# EasyEDA schematic Schematic_kr04-Color_v1.0.0.json
TITLE: Блок цветности "Электроника-КР04"; REV: 1.0.0; Date: 2024-12-30; Sheet: 1/1; Drawn By: Romych; Company: zx-pk.ru
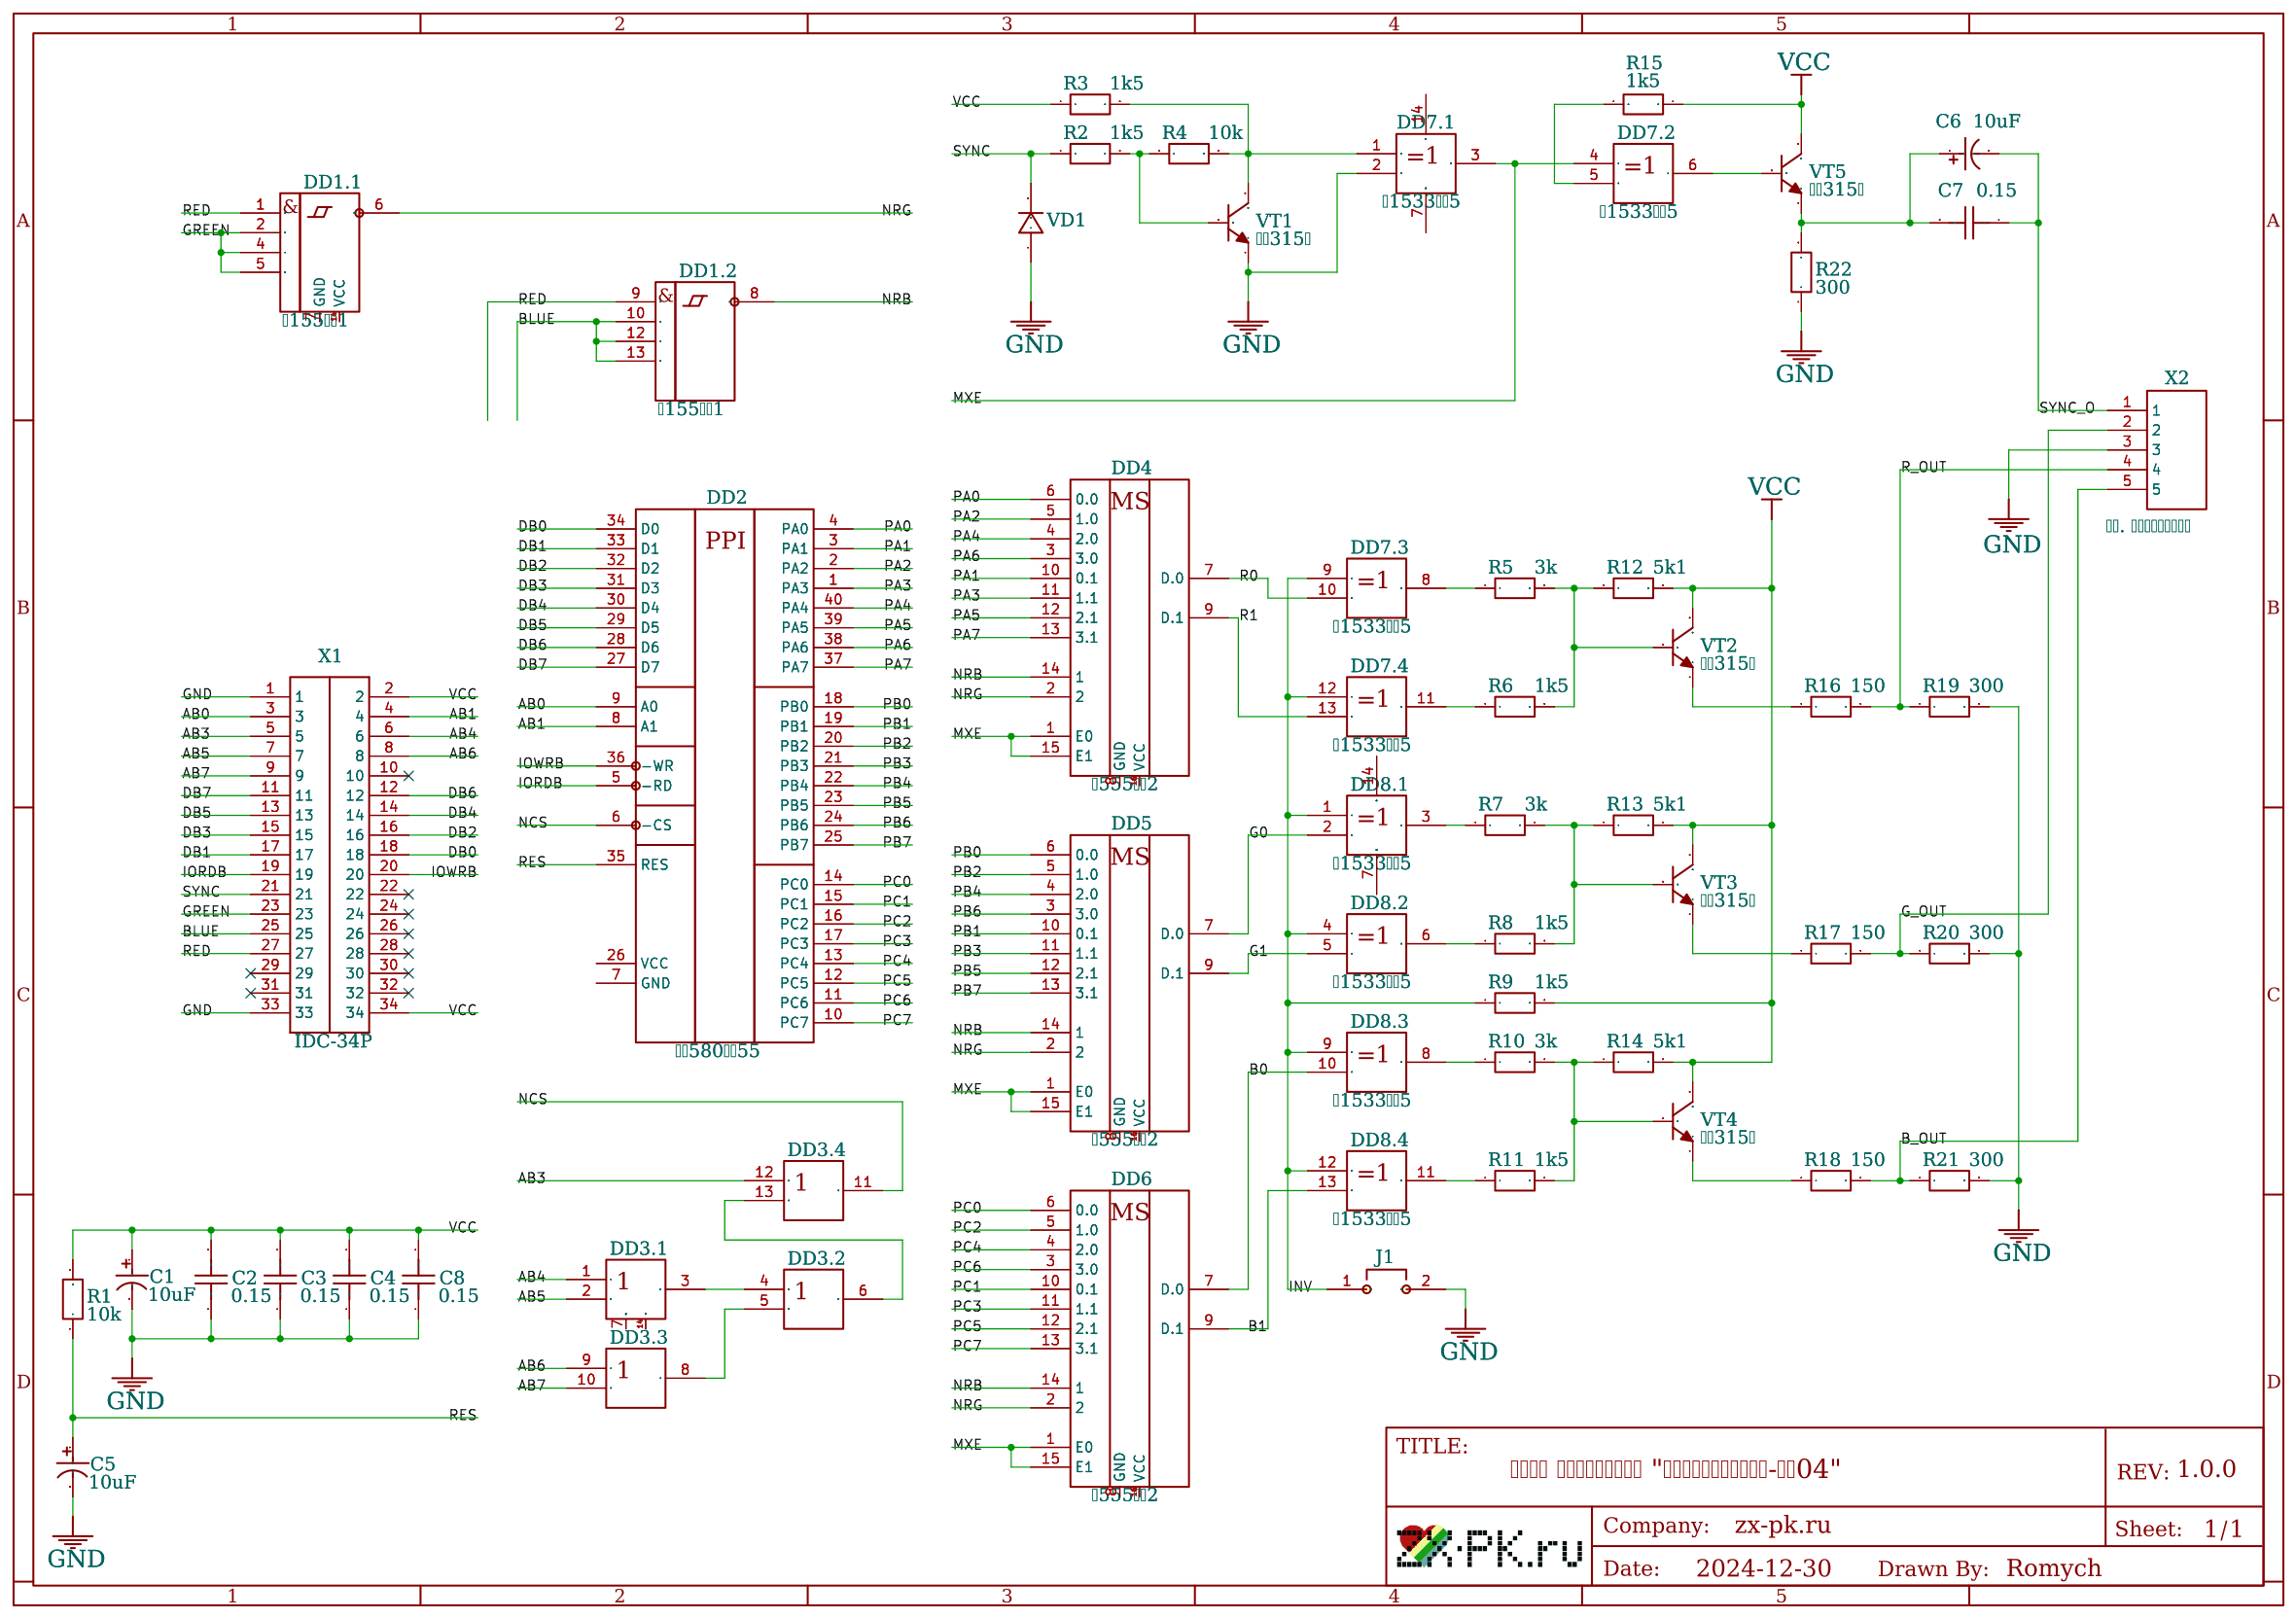
[diagram p0: schematic sheet]

## Parts
C1  10uF  [CAP-TH_BD6.3-P2.50-D1.0-FD]
C2  0.15  [CAP-TH_L5.08]
C3  0.15  [CAP-TH_L5.08]
C4  0.15  [CAP-TH_L5.08]
C5  10uF  [CAP-TH_BD6.3-P2.50-D1.0-FD]
C6  10uF  [CAP-TH_BD6.3-P2.50-D1.0-FD]
C7  0.15  [CAP-TH_L5.08]
C8  0.15  [CAP-TH_L5.08]
DD1  К155ТЛ1  [DIP-14_STD]  (sections 1,2)
DD2  КР580ВВ55  [DIP-40_STD]
DD3  К1533ЛЛ1  [DIP-14_STD]  (sections 1,2,3,4)
DD4  К555КП2  [DIP-16_STD]
DD5  К555КП2  [DIP-16_STD]
DD6  К555КП2  [DIP-16_STD]
DD7  К1533ЛП5  [DIP-14_STD]  (sections 1,2,3,4)
DD8  К1533ЛП5  [DIP-14_STD]  (sections 1,2,3,4)
J1  Inverse  [HDR-TH_2P-P2.54-V-M]
R1  10k  [R_0.125_7.62]
R2  1k5  [R_0.125_7.62]
R3  1k5  [R_0.125_7.62]
R4  10k  [R_0.125_7.62]
R5  3k  [R_0.125_7.62]
R6  1k5  [R_0.125_7.62]
R7  3k  [R_0.125_7.62]
R8  1k5  [R_0.125_7.62]
R9  1k5  [R_0.125_7.62]
R10  3k  [R_0.125_7.62]
R11  1k5  [R_0.125_7.62]
R12  5k1  [R_0.125_7.62]
R13  5k1  [R_0.125_7.62]
R14  5k1  [R_0.125_7.62]
R15  1k5  [R_0.125_7.62]
R16  150  [R_0.125_7.62]
R17  150  [R_0.125_7.62]
R18  150  [R_0.125_7.62]
R19  300  [R_0.125_7.62]
R20  300  [R_0.125_7.62]
R21  300  [R_0.125_7.62]
R22  300  [R_0.125_7.62]
VD1  1N4148  [DIODE_TH_7.62]
VT1  КТ315Б  [KT315_STD]
VT2  КТ315Б  [KT315_STD]
VT3  КТ315Б  [KT315_STD]
VT4  КТ315Б  [KT315_STD]
VT5  КТ315Б  [KT315_STD]
X1  IDC-34P  [IDC-TH-34P-17X2_2.54]
X2  ЦВ. ТЕЛЕВИЗОР  [SG5-TH]

## Library data of the parts
C1 C5 C6 = ECLJ0612220M101P00: Supplier: LCSC; Supplier Part: C156809; Manufacturer: Guangdong TOPAZ Elec Tech; Contributor: LCSC
C2-C4 C7 C8 = CK45-R3AD152K-VRY: Supplier: LCSC; Supplier Part: C340608; Manufacturer: TDK; Contributor: LCSC; JLCPCB Part Class: Extended Part
DD1 = К155ТЛ1: Contributor: Roman Boykov; subpart_no: 1
DD2 = КР580ВВ55: Supplier: chipdip; Contributor: romychs_4693
DD3 = К1533ЛЛ1: Supplier: chipdip; Contributor: Roman Boykov; subpart_no: 1
DD4-DD6 = К555КП2: Supplier: chipdip; Contributor: romychs_4693
DD7 = К1533ЛП5: Supplier: chipdip; Contributor: Roman Boykov; subpart_no: 1
DD8 = К1533ЛП5: Supplier: chipdip; Contributor: Roman Boykov; subpart_no: 3
J1 = Jumper-2PM: Contributor: Roman Boykov
R1 = R_0603_EU: Contributor: LCEDA_Lib
R2-R22 = RN 1/8W 470R F T/B A1: Supplier: LCSC; Supplier Part: C433478; Manufacturer: Tyohm(幸亚电阻); Contributor: LCSC; JLCPCB Part Class: Extended Part
VD1 = 1N4148: Contributor: EasyEDA
VT1-VT5 = КТ315Б: Supplier: LCSC; Manufacturer: Russia; Manufacturer Part: КТ315; Supplier Part: КТ315; JLCPCB Part Class: Extended Part
X1 = IDC-TH-34P-17x2_2.54: Manufacturer: Connfy; Contributor: romychs_4693
X2 = СГ5: Contributor: Roman Boykov

## Nets
GND: C1.2 C2.1 C3.1 C4.1 C5.2 C8.1 DD7.2 J1.2 R19.2 R20.2 R21.2 R22.1 VD1.1(A) VT1.1(E) X1.1 X1.33 X2.3
VCC: C1.1 C2.2 C3.2 C4.2 C8.2 R1.2 R3.1 R9.2 R12.2 R13.2 R14.2 R15.1 VT2.2(C) VT3.2(C) VT4.2(C) VT5.2(C) X1.2 X1.34
AB0: DD2.9(A0) X1.3
AB1: DD2.8(A1) X1.4
AB3: DD3.12(1) X1.5
AB4: DD3.1 X1.6
AB5: DD3.2 X1.7
AB6: DD3.9(1) X1.8
AB7: DD3.10(2) X1.9
B0: DD6.7(D.0) DD8.10(2)
B1: DD6.9(D.1) DD8.13(2)
B_OUT: R18.2 R21.1 X2.5
BLUE: DD1.10(2) DD1.12(4) DD1.13(5) X1.25
DB0: DD2.34(D0) X1.18
DB1: DD2.33(D1) X1.17
DB2: DD2.32(D2) X1.16
DB3: DD2.31(D3) X1.15
DB4: DD2.30(D4) X1.14
DB5: DD2.29(D5) X1.13
DB6: DD2.28(D6) X1.12
DB7: DD2.27(D7) X1.11
G0: DD5.7(D.0) DD8.2
G1: DD5.9(D.1) DD8.5(2)
G_OUT: R17.2 R20.1 X2.2
GREEN: DD1.2 DD1.4 DD1.5 X1.23
INV: DD7.9(1) DD7.12(1) DD8.1 DD8.4(1) DD8.9(1) DD8.12(1) J1.1 R9.1
IORDB: DD2.5(-RD) X1.19
IOWRB: DD2.36(-WR) X1.20
MXE: DD4.1(E0) DD4.15(E1) DD5.1(E0) DD5.15(E1) DD6.1(E0) DD6.15(E1) DD7.3 DD7.4(1)
NCS: DD2.6(-CS) DD3.11(3)
NRB: DD1.8(6) DD4.14(1) DD5.14(1) DD6.14(1)
NRG: DD1.6 DD4.2 DD5.2 DD6.2
PA0: DD2.4(PA0) DD4.6(0.0)
PA1: DD2.3(PA1) DD4.10(0.1)
PA2: DD2.2(PA2) DD4.5(1.0)
PA3: DD2.1(PA3) DD4.11(1.1)
PA4: DD2.40(PA4) DD4.4(2.0)
PA5: DD2.39(PA5) DD4.12(2.1)
PA6: DD2.38(PA6) DD4.3(3.0)
PA7: DD2.37(PA7) DD4.13(3.1)
PB0: DD2.18(PB0) DD5.6(0.0)
PB1: DD2.19(PB1) DD5.10(0.1)
PB2: DD2.20(PB2) DD5.5(1.0)
PB3: DD2.21(PB3) DD5.11(1.1)
PB4: DD2.22(PB4) DD5.4(2.0)
PB5: DD2.23(PB5) DD5.12(2.1)
PB6: DD2.24(PB6) DD5.3(3.0)
PB7: DD2.25(PB7) DD5.13(3.1)
PC0: DD2.14(PC0) DD6.6(0.0)
PC1: DD2.15(PC1) DD6.10(0.1)
PC2: DD2.16(PC2) DD6.5(1.0)
PC3: DD2.17(PC3) DD6.11(1.1)
PC4: DD2.13(PC4) DD6.4(2.0)
PC5: DD2.12(PC5) DD6.12(2.1)
PC6: DD2.11(PC6) DD6.3(3.0)
PC7: DD2.10(PC7) DD6.13(3.1)
R0: DD4.7(D.0) DD7.10(2)
R1: DD4.9(D.1) DD7.13(2)
R_OUT: R16.2 R19.1 X2.4
RED: DD1.1 DD1.9(1) X1.27
RES: C5.1 DD2.35(RES) R1.1
SYNC: R2.1 VD1.2(K) X1.21
SYNC_O: C6.2 C7.1 X2.1
Net-(C6-1): C6.1 C7.2 R22.2 VT5.1(E)
Net-(DD3.1-3): DD3.3 DD3.4(1)
Net-(DD3.2-5): DD3.5(2) DD3.8(3)
Net-(DD3.2-6): DD3.6(3) DD3.13(2)
Net-(DD7.1-1): DD7.1 R3.2 R4.2 VT1.2(C)
Net-(DD7.2-5): DD7.5(2) R15.2
Net-(DD7.2-6): DD7.6(3) VT5.3(B)
Net-(DD7.3-8): DD7.8(3) R5.1
Net-(DD7.4-11): DD7.11(3) R6.1
Net-(DD8.1-3): DD8.3 R7.1
Net-(DD8.2-6): DD8.6(3) R8.1
Net-(DD8.3-8): DD8.8(3) R10.1
Net-(DD8.4-11): DD8.11(3) R11.1
Net-(R2-2): R2.2 R4.1 VT1.3(B)
Net-(R5-2): R5.2 R6.2 R12.1 VT2.3(B)
Net-(R7-2): R7.2 R8.2 R13.1 VT3.3(B)
Net-(R10-2): R10.2 R11.2 R14.1 VT4.3(B)
Net-(R16-1): R16.1 VT2.1(E)
Net-(R17-1): R17.1 VT3.1(E)
Net-(R18-1): R18.1 VT4.1(E)

Not connected (* = marked no-connect by the designer): DD1 7(GND) 14(VCC); DD2 7(GND) 26(VCC); DD3 7(GND) 14(VCC); DD4 8(GND) 16(VCC); DD5 8(GND) 16(VCC); DD6 8(GND) 16(VCC); DD7 7(GND) 14(VCC); DD8 7(GND) 14(VCC); X1 10* 22* 24* 26* 28* 29* 30* 31* 32*
